# EAGLE design RedVThingPlus (EAGLE 9.1.0)

## Sheet 1 of 2
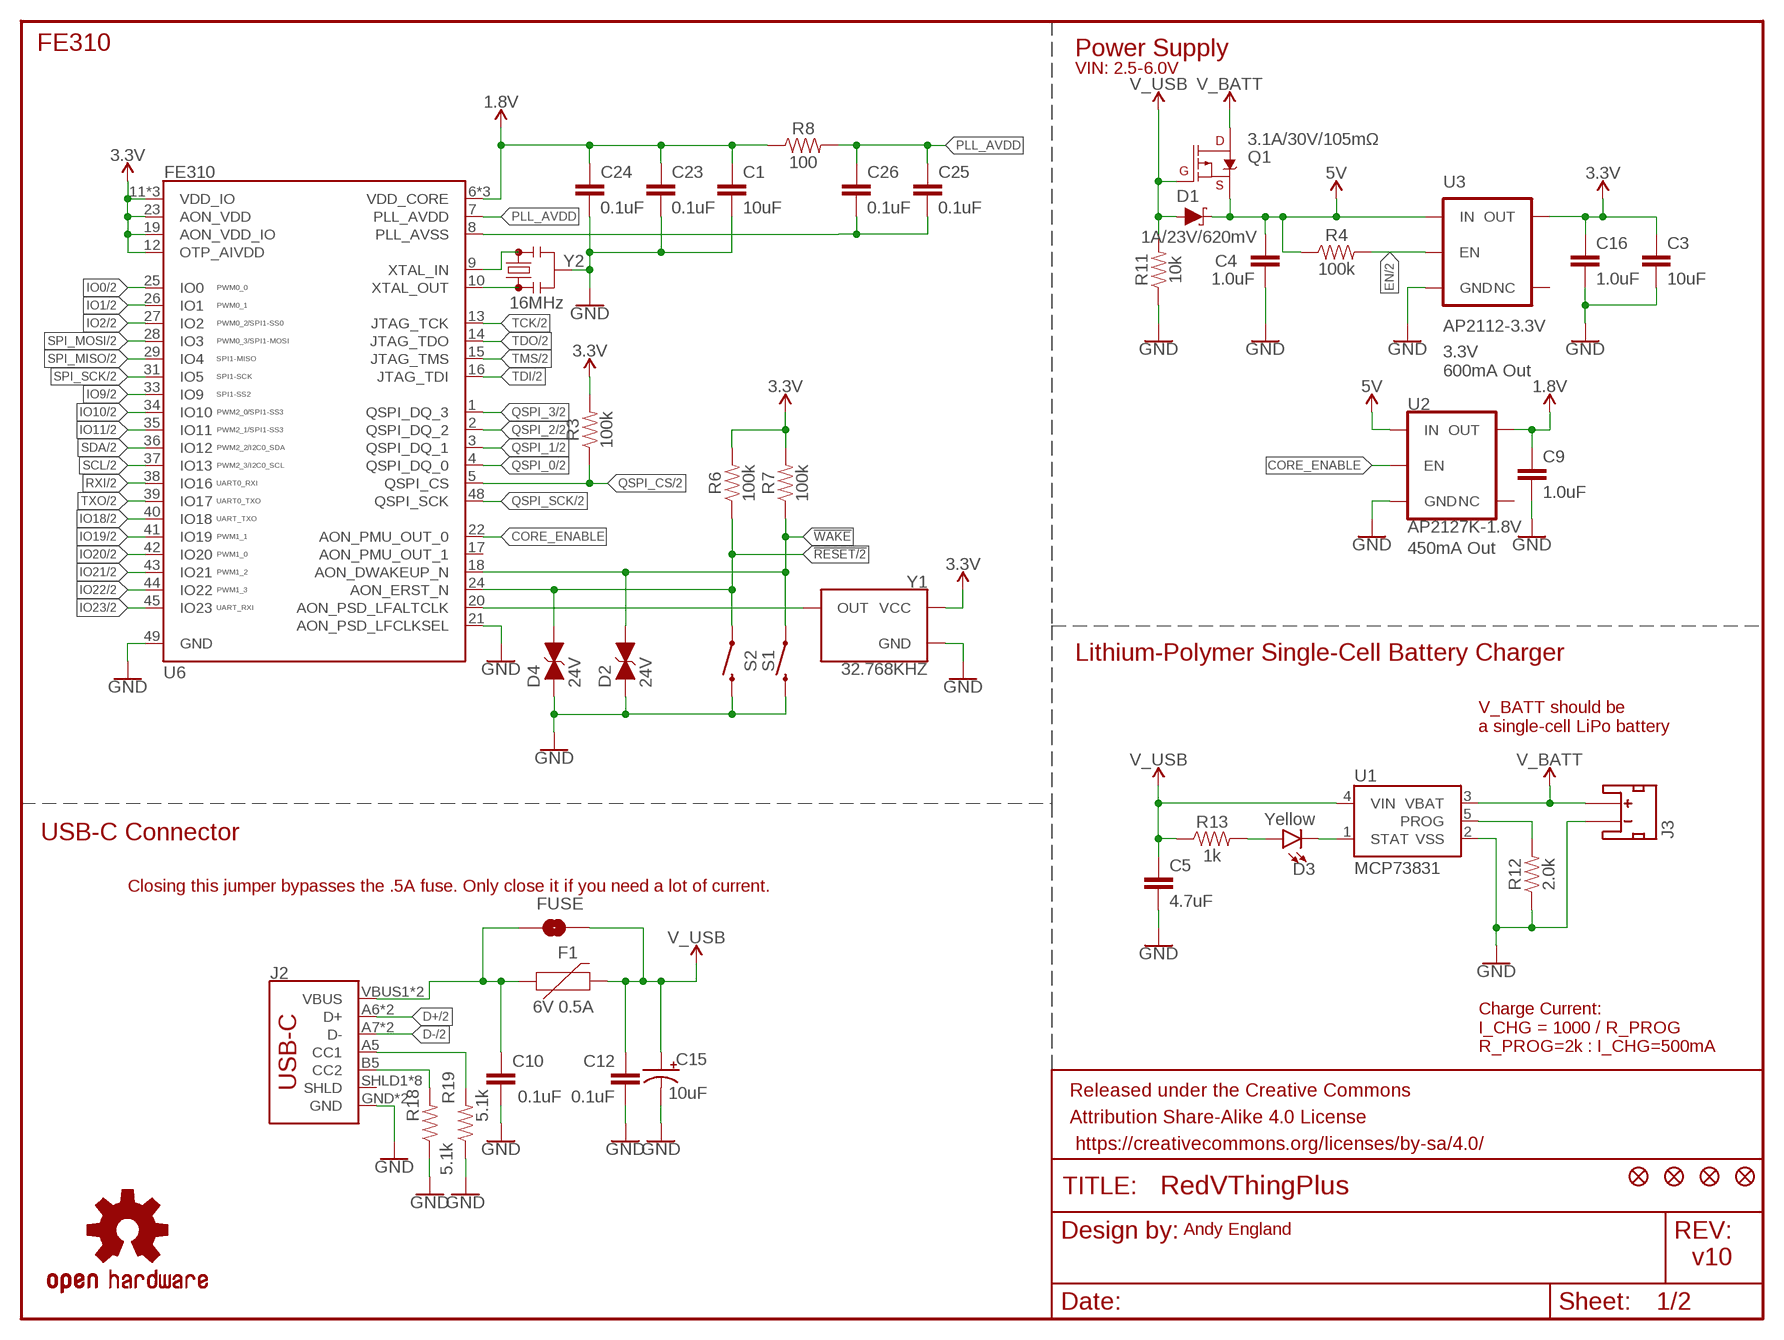
[diagram p0: schematic, sheet 1]

### Parts
C1  10uF  10UF-0603-6.3V-20%  [0603]
C3  10uF  10UF-0603-6.3V-20%  [0603]
C4  1.0uF  1.0UF-0603-16V-10%  [0603]
C5  4.7uF  4.7UF-0603-6.3V-(10%)  [0603]
C9  1.0uF  1.0UF-0603-16V-10%  [0603]
C10  0.1uF  0.1UF-0603-25V-(+80/-20%)  [0603]
C12  0.1uF  0.1UF-0603-25V-(+80/-20%)  [0603]
C15  10uF  10UF-POLAR-EIA3216-16V-10%(TANT)  [EIA3216]
C16  1.0uF  1.0UF-0603-16V-10%  [0603]
C23  0.1uF  0.1UF-0603-25V-(+80/-20%)  [0603]
C24  0.1uF  0.1UF-0603-25V-(+80/-20%)  [0603]
C25  0.1uF  0.1UF-0603-25V-(+80/-20%)  [0603]
C26  0.1uF  0.1UF-0603-25V-(+80/-20%)  [0603]
D1  1A/23V/620mV  DIODE-SCHOTTKY-BAT20J  [SOD-323]
D2  24V  DIODE_TVS  [0603]
D3  Yellow  LED-YELLOW0603  [LED-0603]
D4  24V  DIODE_TVS  [0603]
F1  6V 0.5A  PPTC_6V500MA  [0805]
FRAME2  FRAME-LETTER  [CREATIVE_COMMONS]
FUSE  JUMPER-SMT_2_NO_NO-SILK  [SMT-JUMPER_2_NO_NO-SILK]
J2  USB Female Type C Connector  USB_C2-LAYER  [USB-C-16P]
J3  JST_2MM_MALE  [JST-2-SMD]
JP8  FIDUCIAL1X2  [FIDUCIAL-1X2]
JP9  FIDUCIAL1X2  [FIDUCIAL-1X2]
JP15  FIDUCIAL1X2  [FIDUCIAL-1X2]
JP16  FIDUCIAL1X2  [FIDUCIAL-1X2]
Q1  3.1A/30V/105mΩ  MOSFET_PCH-DMG2307L  [SOT23-3]
R3  100k  100KOHM-0603-1/10W-1%  [0603]
R4  100k  100KOHM-0603-1/10W-1%  [0603]
R6  100k  100KOHM-0603-1/10W-1%  [0603]
R7  100k  100KOHM-0603-1/10W-1%  [0603]
R8  100  100OHM-0603-1/10W-1%  [0603]
R11  10k  10KOHM-0603-1/10W-1%  [0603]
R12  2.0k  2.0KOHM-0603-1/10W-5%  [0603]
R13  1k  1KOHM-0603-1/10W-1%  [0603]
R18  5.1k  5.1KOHM5.1KOHM-0603-1/10W-1%  [0603]
R19  5.1k  5.1KOHM5.1KOHM-0603-1/10W-1%  [0603]
S1  MOMENTARY-SWITCH-SPST-SMD-4.6X2.8MM  [TACTILE_SWITCH_SMD_4.6X2.8MM]
S2  MOMENTARY-SWITCH-SPST-SMD-4.6X2.8MM  [TACTILE_SWITCH_SMD_4.6X2.8MM]
U1  MCP73831  [SOT23-5]
U2  AP2127K-1.8V  V_REG_AP2127K-1.8V  [SOT23-5]
U3  AP2112-3.3V  V_REG_AP2112K-3.3V  [SOT23-5]
U6  FE310  SIFIVE_FE310  [QFN-48-.4MMPITCH]
U$16  OSHW-LOGOS  [OSHW-LOGO-S]
Y1  32.768KHZ  SITIME-CRYSTAL-32.768KHZ  [CRYSTAL-SMD-2X1.2MM]
Y2  16MHz  RESONATOR-16MHZSMD_3.2X1.3  [RESONATOR-SMD-3.2X1.3]

### Nets
1.8V: C1.1 C9.1 C23.1 C24.1 R8.1 U2.5(OUT) U6.6(VDD_CORE) U6.30(VDD_CORE) U6.46(VDD_CORE)
3.3V: C3.1 C16.1 R3.2 R6.2 R7.2 U3.5(OUT) U6.11(VDD_IO) U6.12(OTP_AIVDD) U6.19(AON_VDD_IO) U6.23(AON_VDD) U6.32(VDD_IO) U6.47(VDD_IO) Y1.4(VCC) ; also sheet 2
5V: C4.1 D1.C Q1.2(S) R4.1 U2.1(IN) U3.1(IN)
!RESET: D4.2(C) R6.1 S2.1 S2.2 U6.24(AON_ERST_N) ; also sheet 2
!WAKE: D2.2(C) R7.1 S1.1 S1.2 U6.18(AON_DWAKEUP_N)
CORE_ENABLE: U2.3(EN) U6.22(AON_PMU_OUT_0)
D+: J2.A6(D+) J2.B6(D+) ; also sheet 2
D-: J2.A7(D-) J2.B7(D-) ; also sheet 2
EN: R4.2 U3.3(EN) ; also sheet 2
GND: C1.2 C3.2 C4.2 C5.2 C9.2 C10.2 C12.2 C15.- C16.2 C23.2 C24.2 D2.1(A) D4.1(A) J2.GND J2.GND2(GND) J3.1(-) R11.1 R12.1 R18.1 R19.1 S1.3 S1.4 S2.3 S2.4 U1.2(VSS) U2.2(GND) U3.2(GND) U6.21(AON_PSD_LFCLKSEL) U6.49(GND) Y1.2(GND) Y2.2 ; also sheet 2
IO0: U6.25(IO0) ; also sheet 2
IO1: U6.26(IO1) ; also sheet 2
IO2: U6.27(IO2) ; also sheet 2
IO9: U6.33(IO9) ; also sheet 2
IO10: U6.34(IO10) ; also sheet 2
IO11: U6.35(IO11) ; also sheet 2
IO18: U6.40(IO18) ; also sheet 2
IO19: U6.41(IO19) ; also sheet 2
IO20: U6.42(IO20) ; also sheet 2
IO21: U6.43(IO21) ; also sheet 2
IO22: U6.44(IO22) ; also sheet 2
IO23: U6.45(IO23) ; also sheet 2
N$3: U6.10(XTAL_OUT) Y2.1
N$7: U6.9(XTAL_IN) Y2.3
N$8: U6.20(AON_PSD_LFALTCLK) Y1.3(OUT)
N$9: R12.2 U1.5(PROG)
N$10: C25.2 C26.2 U6.8(PLL_AVSS)
N$11: D3.C U1.1(STAT)
N$12: J2.B5(CC2) R18.2
N$14: D3.A R13.2
N$17: J2.A5(CC1) R19.2
PLL_AVDD: C25.1 C26.1 R8.2 U6.7(PLL_AVDD)
QSPI_0: U6.4(QSPI_DQ_0) ; also sheet 2
QSPI_1: U6.3(QSPI_DQ_1) ; also sheet 2
QSPI_2: U6.2(QSPI_DQ_2) ; also sheet 2
QSPI_3: U6.1(QSPI_DQ_3) ; also sheet 2
QSPI_CS: R3.1 U6.5(QSPI_CS) ; also sheet 2
QSPI_SCK: U6.48(QSPI_SCK) ; also sheet 2
RXI: U6.38(IO16) ; also sheet 2
SCL: U6.37(IO13) ; also sheet 2
SDA: U6.36(IO12) ; also sheet 2
SPI_MISO: U6.29(IO4) ; also sheet 2
SPI_MOSI: U6.28(IO3) ; also sheet 2
SPI_SCK: U6.31(IO5) ; also sheet 2
TCK: U6.13(JTAG_TCK) ; also sheet 2
TDI: U6.16(JTAG_TDI) ; also sheet 2
TDO: U6.14(JTAG_TDO) ; also sheet 2
TMS: U6.15(JTAG_TMS) ; also sheet 2
TXO: U6.39(IO17) ; also sheet 2
V_BATT: J3.2(+) Q1.3(D) U1.3(VBAT) ; also sheet 2
V_USB: C5.1 C12.1 C15.+ D1.A F1.2 FUSE.2 Q1.1(G) R11.2 R13.1 U1.4(VIN) ; also sheet 2
VUSB: C10.1 F1.1 FUSE.1 J2.VBUS1(VBUS) J2.VBUS2(VBUS)
Unconnected: J2.SHLD1(SHLD) J2.SHLD2(SHLD) J2.SHLD3(SHLD) J2.SHLD4(SHLD) J2.SHLD5(SHLD) J2.SHLD6(SHLD) J2.SHLD7(SHLD) J2.SHLD8(SHLD) J3.NC1(PAD1) J3.NC2(PAD2) U2.4(NC) U3.4(NC) U6.17(AON_PMU_OUT_1)

### Notes on the sheet
- FE310 | Power Supply
- VIN: 2.5-6.0V
- 3.3V
  600mA Out
- 450mA Out
- Lithium-Polymer Single-Cell Battery Charger
- V_BATT should be
  a single-cell LiPo battery
- USB-C Connector
- Closing this jumper bypasses the .5A fuse. Only close it if you need a lot of current.
- Charge Current:
  I_CHG = 1000 / R_PROG
  R_PROG=2k : I_CHG=500mA
- Andy England
- v10

## Sheet 2 of 2
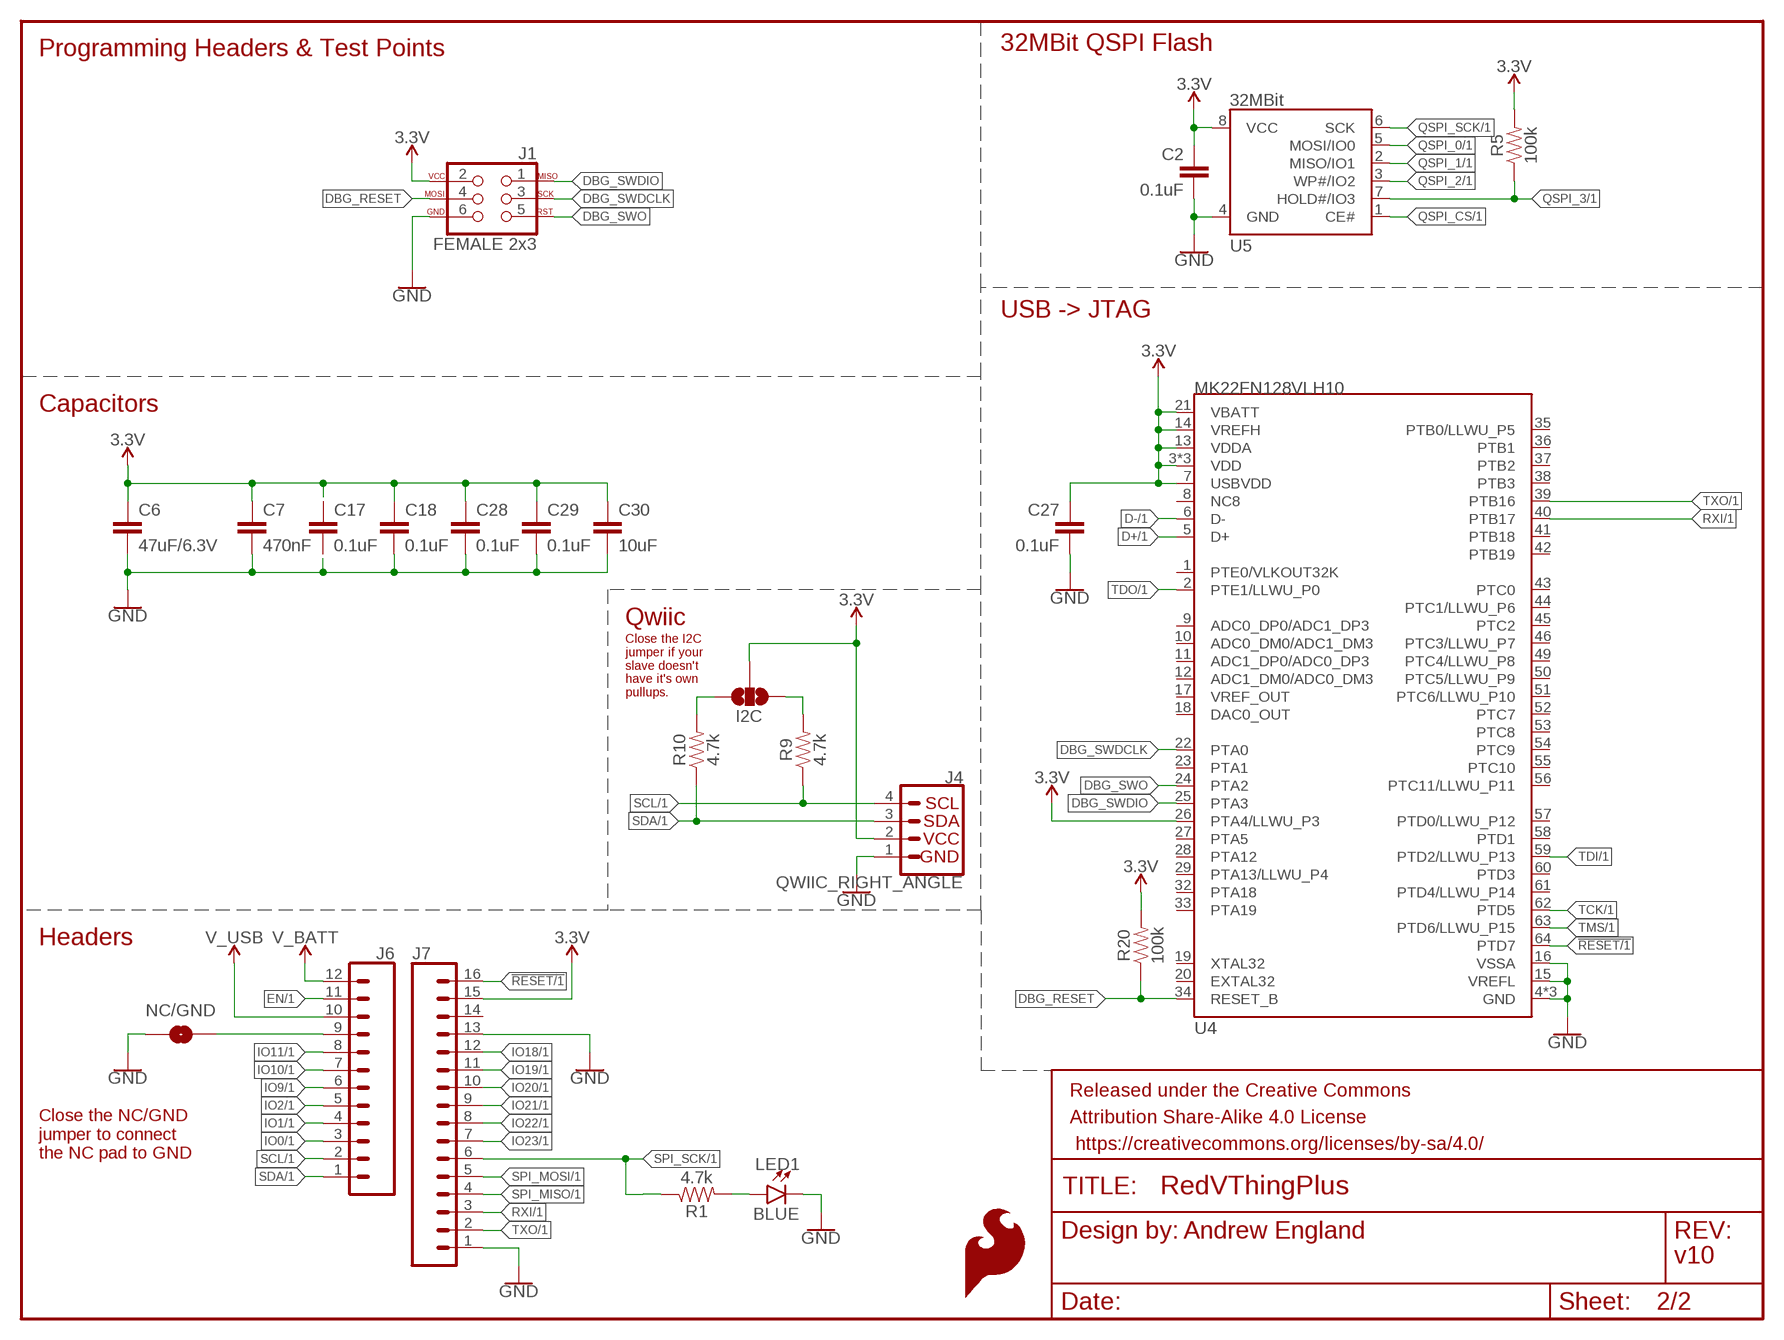
[diagram p1: schematic, sheet 2]

### Parts
C2  0.1uF  0.1UF-0603-25V-(+80/-20%)  [0603]
C6  47uF/6.3V  47UF  [0805]
C7  470nF  470NF-0603-10V-10%-X5R  [0603]
C17  0.1uF  0.1UF-0603-25V-(+80/-20%)  [0603]
C18  0.1uF  0.1UF-0603-25V-(+80/-20%)  [0603]
C27  0.1uF  0.1UF-0603-25V-(+80/-20%)  [0603]
C28  0.1uF  0.1UF-0603-25V-(+80/-20%)  [0603]
C29  0.1uF  0.1UF-0603-25V-(+80/-20%)  [0603]
C30  10uF  10UF-0603-6.3V-20%  [0603]
FRAME1  FRAME-LETTER  [CREATIVE_COMMONS]
I2C  JUMPER-SMT_3_NO_NO-SILK  [SMT-JUMPER_3_NO_NO-SILK]
J1  FEMALE 2x3  AVR_SPI_PROG_3X2TESTPOINTS  [2X3_TEST_POINTS]
J4  QWIIC_RIGHT_ANGLE  QWIIC_CONNECTORJS-1MM  [JST04_1MM_RA]
J6  CONN_12SM_SQ_NO_SILK  [1X12_SM_SQ_NOSILK]
J7  CONN_161X16_SM_SQ_NOSILK  [1X16_SM_SQ_NOSILK]
LED1  BLUE  LED-BLUE0603  [LED-0603]
LOGO2  SFE_LOGO_FLAME.2_INCH  [SFE_LOGO_FLAME_.2]
NC/GND  JUMPER-SMT_2_NO_NO-SILK  [SMT-JUMPER_2_NO_NO-SILK]
R1  4.7k  4.7KOHM-0603-1/10W-1%  [0603]
R5  100k  100KOHM-0603-1/10W-1%  [0603]
R9  4.7k  4.7KOHM-0603-1/10W-1%  [0603]
R10  4.7k  4.7KOHM-0603-1/10W-1%  [0603]
R20  100k  100KOHM-0603-1/10W-1%  [0603]
U4  MK22FN128VLH10  [LQFP-64]
U5  32MBit  QSPI32MBIT  [SO08]

### Nets
3.3V: C2.1 C6.1 C7.1 C17.1 C18.1 C27.1 C28.1 C29.1 C30.1 I2C.2 J1.2 J4.2 J7.15 R5.2 R20.2 U4.3(VDD) U4.7(USBVDD) U4.13(VDDA) U4.14(VREFH) U4.21(VBATT) U4.26(PTA4/LLWU_P3) U4.30(VDD) U4.48(VDD) U5.8(VCC) ; also sheet 1
!RESET: J7.16 U4.64(PTD7) ; also sheet 1
D+: U4.5(D+) ; also sheet 1
D-: U4.6(D-) ; also sheet 1
DBG_RESET: J1.4 R20.1 U4.34(RESET_B)
DBG_SWDCLK: J1.3 U4.22(PTA0)
DBG_SWDIO: J1.1 U4.25(PTA3)
DBG_SWO: J1.5 U4.24(PTA2)
EN: J6.11 ; also sheet 1
GND: C2.2 C6.2 C7.2 C17.2 C18.2 C27.2 C28.2 C29.2 C30.2 J1.6 J4.1 J7.1 J7.13 LED1.C NC/GND.1 U4.4(GND) U4.15(VREFL) U4.16(VSSA) U4.31(GND) U4.47(GND) U5.4(GND) ; also sheet 1
IO0: J6.3 ; also sheet 1
IO1: J6.4 ; also sheet 1
IO2: J6.5 ; also sheet 1
IO9: J6.6 ; also sheet 1
IO10: J6.7 ; also sheet 1
IO11: J6.8 ; also sheet 1
IO18: J7.12 ; also sheet 1
IO19: J7.11 ; also sheet 1
IO20: J7.10 ; also sheet 1
IO21: J7.9 ; also sheet 1
IO22: J7.8 ; also sheet 1
IO23: J7.7 ; also sheet 1
N$1: LED1.A R1.2
N$4: J6.9 NC/GND.2
N$5: I2C.1 R9.2
N$6: I2C.3 R10.2
QSPI_0: U5.5(MOSI/IO0) ; also sheet 1
QSPI_1: U5.2(MISO/IO1) ; also sheet 1
QSPI_2: U5.3(WP#/IO2) ; also sheet 1
QSPI_3: R5.1 U5.7(HOLD#/IO3) ; also sheet 1
QSPI_CS: U5.1(CE#) ; also sheet 1
QSPI_SCK: U5.6(SCK) ; also sheet 1
RXI: J7.3 U4.40(PTB17) ; also sheet 1
SCL: J4.4 J6.2 R9.1 ; also sheet 1
SDA: J4.3 J6.1 R10.1 ; also sheet 1
SPI_MISO: J7.4 ; also sheet 1
SPI_MOSI: J7.5 ; also sheet 1
SPI_SCK: J7.6 R1.1 ; also sheet 1
TCK: U4.62(PTD5) ; also sheet 1
TDI: U4.59(PTD2/LLWU_P13) ; also sheet 1
TDO: U4.2(PTE1/LLWU_P0) ; also sheet 1
TMS: U4.63(PTD6/LLWU_P15) ; also sheet 1
TXO: J7.2 U4.39(PTB16) ; also sheet 1
V_BATT: J6.12 ; also sheet 1
V_USB: J6.10 ; also sheet 1
Unconnected: J7.14 U4.1(PTE0/VLKOUT32K) U4.8(NC8) U4.9(ADC0_DP0/ADC1_DP3) U4.10(ADC0_DM0/ADC1_DM3) U4.11(ADC1_DP0/ADC0_DP3) U4.12(ADC1_DM0/ADC0_DM3) U4.17(VREF_OUT) U4.18(DAC0_OUT) U4.19(XTAL32) U4.20(EXTAL32) U4.23(PTA1) U4.27(PTA5) U4.28(PTA12) U4.29(PTA13/LLWU_P4) U4.32(PTA18) U4.33(PTA19) U4.35(PTB0/LLWU_P5) U4.36(PTB1) U4.37(PTB2) U4.38(PTB3) U4.41(PTB18) U4.42(PTB19) U4.43(PTC0) U4.44(PTC1/LLWU_P6) U4.45(PTC2) U4.46(PTC3/LLWU_P7) U4.49(PTC4/LLWU_P8) U4.50(PTC5/LLWU_P9) U4.51(PTC6/LLWU_P10) U4.52(PTC7) U4.53(PTC8) U4.54(PTC9) U4.55(PTC10) U4.56(PTC11/LLWU_P11) U4.57(PTD0/LLWU_P12) U4.58(PTD1) U4.60(PTD3) U4.61(PTD4/LLWU_P14)

### Notes on the sheet
- Programming Headers & Test Points | 32MBit QSPI Flash
- USB -> JTAG
- Capacitors
- Qwiic
- Close the I2C
  jumper if your
  slave doesn't
  have it's own
  pullups.
- Headers
- Close the NC/GND
  jumper to connect
  the NC pad to GND
- Andrew England
- v10

## Library data of the parts
C1 C3 C30 = SparkFun-Capacitors:10UF: 10.0µF ceramic capacitors A capacitor is a passive two-terminal electrical component used to store electrical energy temporarily in an electric field.; PROD_ID: CAP-11015
C2 C10 C12 C17 C18 C23-C29 = SparkFun-Capacitors:0.1UF: 0.1µF ceramic capacitors A capacitor is a passive two-terminal electrical component used to store electrical energy temporarily in an electric field.; PROD_ID: CAP-00810
C4 C9 C16 = SparkFun-Capacitors:1.0UF: 1µF ceramic capacitors A capacitor is a passive two-terminal electrical component used to store electrical energy temporarily in an electric field.; PROD_ID: CAP-00868
C5 = SparkFun-Capacitors:4.7UF: 4.7µF ceramic capacitors A capacitor is a passive two-terminal electrical component used to store electrical energy temporarily in an electric field.; PROD_ID: CAP-08280
C6 = SparkFun-Capacitors:47UF; PROD_ID: CAP-13854
C7 = SparkFun-Capacitors:470NF: 0.47uF/470nF ceramic capacitors A capacitor is a passive two-terminal electrical component used to store electrical energy temporarily in an electric field.; PROD_ID: CAP-13216
C15 = SparkFun-Capacitors:10UF-POLAR: 10.0µF polarized capacitors A capacitor is a passive two-terminal electrical component used to store electrical energy temporarily in an electric field.; PROD_ID: CAP-00811
D1 = SparkFun-DiscreteSemi:DIODE-SCHOTTKY: Schottky diode A Schottky diode is a semiconductor diode which has a low forward voltage drop and a very fast switching action.; PROD_ID: DIO-11623
D2 D4 = SparkFun-DiscreteSemi:DIODE_TVS; PROD_ID: DIO-14502
D3 = SparkFun-LED:LED-YELLOW: Yellow SMD LED Used in manufacturing several products at SparkFun. Packages: 0603 - SMD 0603 package[Product Link] <http://www.kingbrightusa.com/product.asp?catalog_name=LED&product_id=APT1608SYCK> 0603 -SMART - SMART SMD 0603 package (more efficient/more expensive) [Product Link] <http://www.osram-os.com/osram_os/en/products/product-catalog/led-light-emitting-diodes/smartled-0603/ly-l29k/index.jsp> LilyPad - SMD1206 package[Product Datasheet] <https://www.sparkfun.com/datasheets/DevTools/LilyPad/Q150YUS4.pdf> SparkFun Products: Blynk Board <https://www.sparkfun.com/products/13794> IOIO-OTG <https://www.sparkfun.com/products/13613> XBee Explorer Serial <https://www.sparkfun.com/products/13225>; PROD_ID: DIO-09003
F1 = SparkFun-Fuses:PPTC: Resettable Fuse PPTC Resettable Fuse. Really a sort of resistor with a polymeric positive temperature coefficient whose resistance increases dramatically with an increase in temperature. When heated by the power passing through the resistance rises causing the current to be limited, protecting the circuit. This is achieved by the transition of the polymer from a crystalline to an amorphous state where the conductive carbon separates breaking the conductive pathways found in the cool crystalline structure. When a PPTC cools back down it resumes conducting letting the circuit turn back on. SparkFun Products: SparkFun RedBoard - Programmed with Arduino <https://www.sparkfun.com/products/12757> Pro Micro - 5V/16MHz <https://www.sparkfun.com/products/12640> Arduino Pro 328 - 5V/16MHz <https://www.sparkfun.com/products/10915> MP3 Trigger <https://www.sparkfun.com/products/13720>; PROD_ID: RES-13945
FRAME1 FRAME2 = SparkFun-Aesthetics:FRAME-LETTER: Schematic Frame - Letter Standard 8.5x11 US Letter frame
FUSE NC/GND = SparkFun-Jumpers:JUMPER-SMT_2_NO: Normally open jumper This jumper has two pads in close proximity to each other. Apply solder to close the connection. Round pads are easier to solder for beginners, but are a lot larger. SparkFun Product that uses the round pads: SparkFun EL Sequencer <https://www.sparkfun.com/products/12781>
I2C = SparkFun-Jumpers:JUMPER-SMT_3_NO: Normally open jumper This jumper has three pads in close proximity to each other. Apply solder to close the connection(s).
J1 = SparkFun-Connectors:AVR_SPI_PROG_3X2: AVR ISP 6 Pin This is the reduced ISP connector for AVR programming. Common on Arduino. This footprint will take up less PCB space and can be used with a 10-pin to 6-pin adapter such as SKU: BOB-08508 **Special note about "TEST_POINT" package. The stop mask is on the top side, so if you want your programming test points to be on the bottom of your board, make sure to place this package on the bottom side of the board. This also ensure that the orientation to program from the bottom side will be correct. SparkFun Products: SparkFun ISP Pogo Adapter <https://www.sparkfun.com/products/11591> - NS Tiny AVR Programmer <https://www.sparkfun.com/products/11801> -PTH
J2 = SparkFun-Connectors:USB_C: USB Type C 16Pin Connector Super Speed pins not available on the 16-pin purely SMD connector so this part is best for USB 2.0 implementations. D1 and D2 are tied together enabling D+/- no matter which way the cable is plugged into the connector. The two channel configuration pins (CC1/2) are exposed. These are normally connected to ground via 5.1k resistors but can be reconfigured for high current/high power applications.; PROD_ID: CONN-14122
J3 = SparkFun-Connectors:JST_2MM_MALE: JST 2MM MALE RA CONNECTOR Two pin, compact surface mount connector. Commonly used as a battery input connection point. We really like the solid locking feeling and high current rating on these small connectors. We use these all the time as battery connectors. Mates to single-cell LiPo batteries. Here is the connector we sell at SparkFun: JST Right Angle Connector - White <https://www.sparkfun.com/products/8612> (PRT-08612) Datasheet <http://www.sparkfun.com/datasheets/Prototyping/Connectors/JST-Horizontal.pdf> It was used on these SparkFun products: SparkFun MOSFET Power Controller <https://www.sparkfun.com/products/11214> (PRT-11214) SparkFun Battery Babysitter - LiPo Battery Manager <https://www.sparkfun.com/products/13777> (PRT-13777) And many, many others that required a lipo battery connection.; PROD_ID: CONN-11443; SF_ID: PRT-08612
J4 = SparkFun-Connectors:QWIIC_CONNECTOR: SparkFun I2C Standard Qwiic Connector An SMD 1mm pitch JST connector makes it easy and quick (get it? Qwiic?) to connect I2C devices to each other. The Qwiic system <http://www.sparkfun.com/qwiic> enables fast and solderless connection between popular platforms and various sensors and actuators. We carry 200mm <https://www.sparkfun.com/products/14204>, 100mm <https://www.sparkfun.com/products/14205>, 50mm <https://www.sparkfun.com/products/14206>, and breadboard friendly <https://www.sparkfun.com/products/14207> Qwiic cables. We also offer 10 pcs strips <https://www.sparkfun.com/products/14323> the SMD connectors.; PROD_ID: CONN-13694
J6 = SparkFun-Connectors:CONN_12: Multi connection point. Often used as Generic Header-pin footprint for 0.1 inch spaced/style header connections On any of the 0.1 inch spaced packages, you can populate with these: Break Away Headers - Straight <https://www.sparkfun.com/products/116> (PRT-00116) Break Away Male Headers - Right Angle <https://www.sparkfun.com/products/553> (PRT-00553) Female Headers <https://www.sparkfun.com/products/115> (PRT-00115) Break Away Headers - Machine Pin <https://www.sparkfun.com/products/117> (PRT-00117) Break Away Female Headers - Swiss Machine Pin <https://www.sparkfun.com/products/743> (PRT-00743) For SCREWTERMINALS and SPRING TERMINALS visit here: Screw Terimnals on SparkFun.com <https://www.sparkfun.com/search/results?term=Screw+Terminals> (5mm/3.5mm/2.54mm spacing) This device is also useful as a general connection point to wire up your design to another part of your project. Our various solder wires solder well into these plated through hole pads. Hook-Up Wire - Assortment (Stranded, 22 AWG) <https://www.sparkfun.com/products/11375> (PRT-11375) Hook-Up Wire - Assortment (Solid Core, 22 AWG) <https://www.sparkfun.com/products/11367> (PRT-11367) View the entire wire category on our website here <https://www.sparkfun.com/categories/141> Special notes: Molex polarized connector foot print use with SKU : PRT-08231 with associated crimp pins and housings. 1MM SMD Version SKU: PRT-10208 NOTES ON THE VARIANTS LOCK and LOCK_LONGPADS... This footprint was designed to help hold the alignment of a through-hole component (i.e. 6-pin header) while soldering it into place. You may notice that each hole has been shifted either up or down by 0.005 of an inch from it's more standard position (which is a perfectly straight line). This slight alteration caused the pins (the squares in the middle) to touch the edges of the holes. Because they are alternating, it causes a "brace" to hold the component in place. 0.005 has proven to be the perfect amount of "off-center" position when using our standard breakaway headers. Although looks a little odd when you look at the bare footprint, once you have a header in there, the alteration is very hard to notice. Also,if you push a header all the way into place, it is covered up entirely on the bottom side.
J7 = SparkFun-Connectors:CONN_16: Multi connection point. Often used as Generic Header-pin footprint for 0.1 inch spaced/style header connections On any of the 0.1 inch spaced packages, you can populate with these: Break Away Headers - Straight <https://www.sparkfun.com/products/116> (PRT-00116) Break Away Male Headers - Right Angle <https://www.sparkfun.com/products/553> (PRT-00553) Female Headers <https://www.sparkfun.com/products/115> (PRT-00115) Break Away Headers - Machine Pin <https://www.sparkfun.com/products/117> (PRT-00117) Break Away Female Headers - Swiss Machine Pin <https://www.sparkfun.com/products/743> (PRT-00743) For SCREWTERMINALS and SPRING TERMINALS visit here: Screw Terimnals on SparkFun.com <https://www.sparkfun.com/search/results?term=Screw+Terminals> (5mm/3.5mm/2.54mm spacing) This device is also useful as a general connection point to wire up your design to another part of your project. Our various solder wires solder well into these plated through hole pads. Hook-Up Wire - Assortment (Stranded, 22 AWG) <https://www.sparkfun.com/products/11375> (PRT-11375) Hook-Up Wire - Assortment (Solid Core, 22 AWG) <https://www.sparkfun.com/products/11367> (PRT-11367) View the entire wire category on our website here <https://www.sparkfun.com/categories/141> Special notes: Molex polarized connector foot print use with SKU : PRT-08231 with associated crimp pins and housings. 1MM SMD Version SKU: PRT-10208 NOTES ON THE VARIANTS LOCK and LOCK_LONGPADS... This footprint was designed to help hold the alignment of a through-hole component (i.e. 6-pin header) while soldering it into place. You may notice that each hole has been shifted either up or down by 0.005 of an inch from it's more standard position (which is a perfectly straight line). This slight alteration caused the pins (the squares in the middle) to touch the edges of the holes. Because they are alternating, it causes a "brace" to hold the component in place. 0.005 has proven to be the perfect amount of "off-center" position when using our standard breakaway headers. Although looks a little odd when you look at the bare footprint, once you have a header in there, the alteration is very hard to notice. Also,if you push a header all the way into place, it is covered up entirely on the bottom side.
JP8 JP9 JP15 JP16 = SparkFun:FIDUCIAL: Fiducial Alignment Points Various fiducial points for machine vision alignment.
LED1 = SparkFun-LED:LED-BLUE: Blue SMD LED Used in manufacturing of various products at SparkFun Packages: 0603 - SMD 0603 package [Product Link] <http://www.digikey.com/product-detail/en/SMLE12BC7TT86/511-1589-2-ND/1641808> 1206 - SMD1206 package [Product Link] <http://www.digikey.com/product-detail/en/lite-on-inc/LTST-C150TBKT/160-1643-1-ND/573584> SparkFun Products: ESP8266 Thing-Dev Board <https://www.sparkfun.com/products/13711> RedBoard <https://www.sparkfun.com/products/12757>; PROD_ID: DIO-08575
LOGO2 = SparkFun-Aesthetics:SFE_LOGO_FLAME: SparkFun Flame Logo This is the SparkFun flame logo. The logo on the schematic will always be the same size; the package variant is the height of the flame. Default layer for the logo on the board is tSilk.
Q1 = SparkFun-DiscreteSemi:MOSFET_PCH: P-channel MOSFETs Voltage controlled devices that allow control of high current outputs. SparkFun Products: SparkFun ESP32 Thing <https://www.sparkfun.com/products/13907> SparkFun ESP8266 Thing <https://www.sparkfun.com/products/13231> SparkFun Pi Servo HAT V2 <https://www.sparkfun.com/products/15316> DMG2305UX-7 (20V/4.2A/SOT23-3); PROD_ID: TRANS-11308
R1 R9 R10 = SparkFun-Resistors:4.7KOHM: 4.7kΩ resistor A resistor is a passive two-terminal electrical component that implements electrical resistance as a circuit element. Resistors act to reduce current flow, and, at the same time, act to lower voltage levels within circuits. - Wikipedia; PROD_ID: RES-07857
R3-R7 R20 = SparkFun-Resistors:100KOHM: 100kΩ resistor A resistor is a passive two-terminal electrical component that implements electrical resistance as a circuit element. Resistors act to reduce current flow, and, at the same time, act to lower voltage levels within circuits. - Wikipedia; PROD_ID: RES-07828
R8 = SparkFun-Resistors:100OHM: 100Ω resistor A resistor is a passive two-terminal electrical component that implements electrical resistance as a circuit element. Resistors act to reduce current flow, and, at the same time, act to lower voltage levels within circuits. - Wikipedia; PROD_ID: RES-07863
R11 = SparkFun-Resistors:10KOHM: 10kΩ resistor A resistor is a passive two-terminal electrical component that implements electrical resistance as a circuit element. Resistors act to reduce current flow, and, at the same time, act to lower voltage levels within circuits. - Wikipedia; PROD_ID: RES-00824
R12 = SparkFun-Resistors:2.0KOHM: 2kΩ resistor A resistor is a passive two-terminal electrical component that implements electrical resistance as a circuit element. Resistors act to reduce current flow, and, at the same time, act to lower voltage levels within circuits. - Wikipedia; PROD_ID: RES-08296
R13 = SparkFun-Resistors:1KOHM: 1kΩ resistor A resistor is a passive two-terminal electrical component that implements electrical resistance as a circuit element. Resistors act to reduce current flow, and, at the same time, act to lower voltage levels within circuits. - Wikipedia; PROD_ID: RES-07856
R18 R19 = SparkFun-Resistors:5.1KOHM; PROD_ID: RES-12083
S1 S2 = SparkFun-Switches:MOMENTARY-SWITCH-SPST: Momentary Switch (Pushbutton) - SPST Normally-open (NO) SPST momentary switches (buttons, pushbuttons). Variants PTH-12MM - 12mm square, through-hole Momentary Pushbutton Switch - 12mm Square <https://www.sparkfun.com/products/9190> (COM-09190) PTH-6.0MM, PTH-6.0MM-KIT - 6.0mm square, through-hole Mini Pushbutton Switch <https://www.sparkfun.com/products/97> (COM-00097) KIT package intended for soldering kit's - only one side of pads' copper is exposed. PTH-RIGHT-ANGLE-KIT - Right-angle, through-hole Right Angle Tactile Button <https://www.sparkfun.com/products/10791> - Used on SparkFun BigTime Watch Kit <https://www.sparkfun.com/products/11734> SMD-12MM - 12mm square, surface-mount Tactile Button - SMD (12mm) <https://www.sparkfun.com/products/12993> (COM-12993) Used on SparkFun PicoBoard <https://www.sparkfun.com/products/11888> SMD-4.5MM - 4.5mm Square Trackball Switch Used on SparkFun Blackberry Trackballer Breakout <https://www.sparkfun.com/products/13169> SMD-4.6MMX2.8MM - 4.60mm x 2.80mm, surface mount Used on SparkFun SAMD21 Mini Breakout <https://www.sparkfun.com/products/13664> SMD-5.2MM, SMD-5.2-REDUNDANT - 5.2mm square, surface-mount Mini Pushbutton Switch - SMD <https://www.sparkfun.com/products/8720> (COM-08720) Used on Arduino Pro Mini <https://www.sparkfun.com/products/11114> REDUNDANT package connects both switch circuits together SMD-6.0X3.5MM - 6.0 x 3.5mm, surface mount Momentary Reset Switch SMD <https://www.sparkfun.com/products/8229> (COM-08229) SMD-6.2MM-TALL - 6.2mm square, surface mount Tactile Button - SMD (6mm) <https://www.sparkfun.com/products/12992> Used on SparkFun Digital Sandbox <https://www.sparkfun.com/products/12651> SMD-RIGHT-ANGLE - Right-angle, surface mount Used on SparkFun Block for Intel® Edison - Arduino <https://www.sparkfun.com/products/13036>; PROD_ID: SWCH-13065
U1 = SparkFun-IC-Power:MCP73831: MCP73831T Li-Ion, Li-Pol Controller Miniature single cell, fully integrated Li-Ion, Li-polymer charge management controller Datasheet <http://ww1.microchip.com/downloads/en/DeviceDoc/20001984g.pdf> SparkFun Products: SparkFun ESP32 Thing <https://www.sparkfun.com/products/13907> SparkFun 9DoF Razor IMU M0 <https://www.sparkfun.com/products/14001>; PROD_ID: IC-09995
U2 = SparkFun-IC-Power:V_REG_AP2127: AP2127 - 300mA CMOS LDO Regulator w/ Enable The AP2127 is CMOS process low dropout linear regulator with enable function, the regulator delivers a guaranteed 300mA (min.) continuous load current. Features Output Voltage Accuracy: ±1.5% Output Current: 300mA (Min.) Foldback Short Current Protection: 50mA Enable Function to Turn ON/OFF VOUT Low Dropout Voltage (3.3V): 250mV (Typ.) @IOUT=600mA Excellent Load Regulation: 0.2%/A (Typ.) Excellent Line Regulation: 0.02%/V (Typ.) Low Quiescent Current: 55μA (Typ.) Low Standby Current: 0.01μA (Typ.) Low Output Noise: 50μVRMS PSRR: 100Hz -65dB, 1kHz -65dB OTSD Protection Stable with 1.0μF Flexible Cap: Ceramic, Tantalum and Aluminum Electrolytic Operation Temperature Range: -40°C to 85°C ESD: MM 400V, HBM 4000V; PROD_ID: VREG-14239
U3 = SparkFun-PowerIC:V_REG_AP2112: AP2112 - 600mA CMOS LDO Regulator w/ Enable The AP2112 is CMOS process low dropout linear regulator with enable function, the regulator delivers a guaranteed 600mA (min.) continuous load current. Features Output Voltage Accuracy: ±1.5% Output Current: 600mA (Min.) Foldback Short Current Protection: 50mA Enable Function to Turn ON/OFF VOUT Low Dropout Voltage (3.3V): 250mV (Typ.) @IOUT=600mA Excellent Load Regulation: 0.2%/A (Typ.) Excellent Line Regulation: 0.02%/V (Typ.) Low Quiescent Current: 55μA (Typ.) Low Standby Current: 0.01μA (Typ.) Low Output Noise: 50μVRMS PSRR: 100Hz -65dB, 1kHz -65dB OTSD Protection Stable with 1.0μF Flexible Cap: Ceramic, Tantalum and Aluminum Electrolytic Operation Temperature Range: -40°C to 85°C ESD: MM 400V, HBM 4000V; PROD_ID: VREG-12457; VALUE: 3.3V
U4 = SparkFun-IC-Comms:MK22FN128VLH10: The Kinetis K22 product family members are optimized for costsensitive applications requiring low-power, USB connectivity, high peripheral integration and processing efficiency with a floating-point unit. These devices share the comprehensive enablement and scalability of the Kinetis family.; PROD_ID: IC-14611
U5 = SparkFun-IC-Memory:QSPI32MBIT: Integrated Silicon Solution Inc. IS25LP032D The IS25LP032D Serial Flash memory offers a versatile storage solution with high flexibility and performance in a simplified pin count package. ISSI’s “Industry Standard Serial Interface” Flash is for systems that require limited space, a low pin count, and low power consumption. The device is accessed through a 4-wire SPI Interface consisting of a Serial Data Input (SI), Serial Data Output (SO), Serial Clock (SCK), and Chip Enable (CE#) pins, which can also be configured to serve as multi-I/O (see pin descriptions). Datasheet <http://www.issi.com/WW/pdf/25LP-WP032D.pdf>; PROD_ID: IC-14501
U6 = SparkFun-IC-Microcontroller:SIFIVE_FE310: SiFive FE310 - RISC-V MCU The FE310-G002 is the second Freedom E300 SoC. The FE310-G002 is built around the E31 Core Complex instantiated in the Freedom E300 platform. SparkFun Products: [PRODUCT 1] <[PRODUCT1LINK]>; PROD_ID: IC-14494
U$16 = SparkFun-Aesthetics:OSHW-LOGO: Open-Source Hardware (OSHW) Logo This logo indicates the piece of hardware it is found on incorporates a OSHW license and/or adheres to the definition of open source hardware found here: http://freedomdefined.org/OSHW
Y1 = SparkFun-Clocks:SITIME-CRYSTAL-32.768KHZ; PROD_ID: XTAL-14578
Y2 = SparkFun-Clocks:RESONATOR-16MHZ: 16MHz Resonator Digikey Example <http://www.digikey.com/product-detail/en/murata-electronics-north-america/CSTCE16M0V53-R0/490-1198-1-ND/584635> Frequency: 16MHz Frequency Stability: ±0.3% Frequency Tolerance: ±0.5% Capacitance: 15pF SparkFun Products SparkFun OpenLog <https://www.sparkfun.com/products/13712> SparkFun MicroView - OLED Arduino Module <https://www.sparkfun.com/products/12923>; PROD_ID: XTAL-08900

## Net classes
1 power: width 0.178 mm

## Board
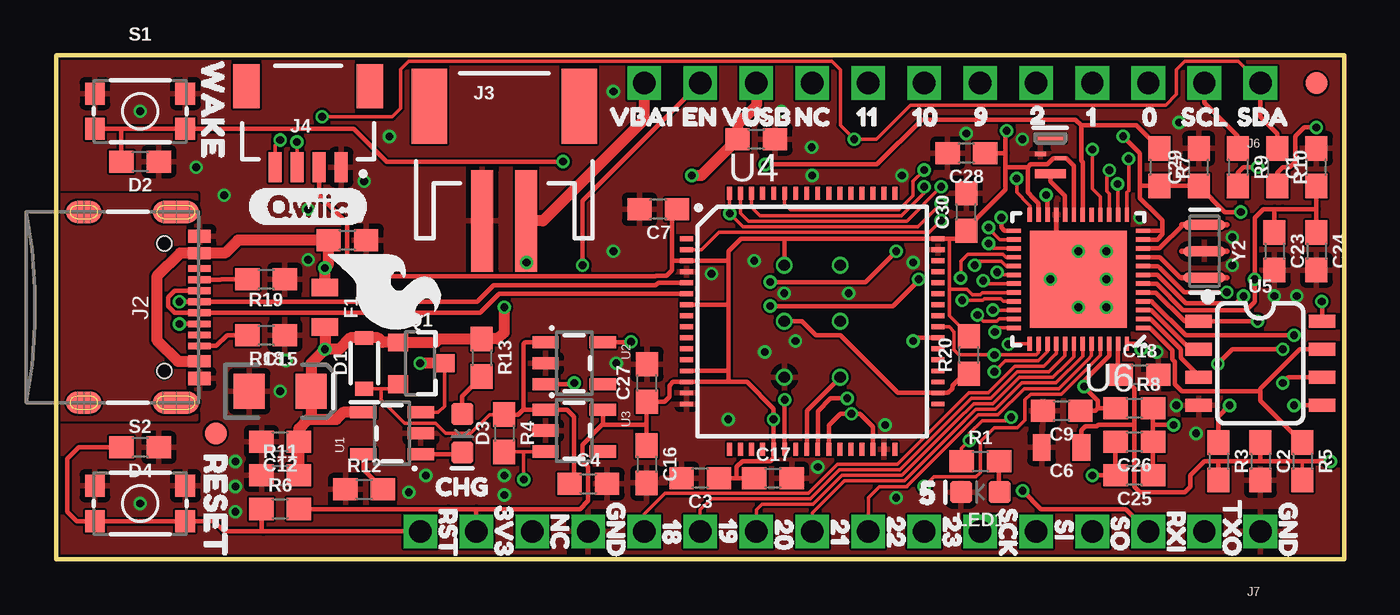
[diagram p2: board, top side]
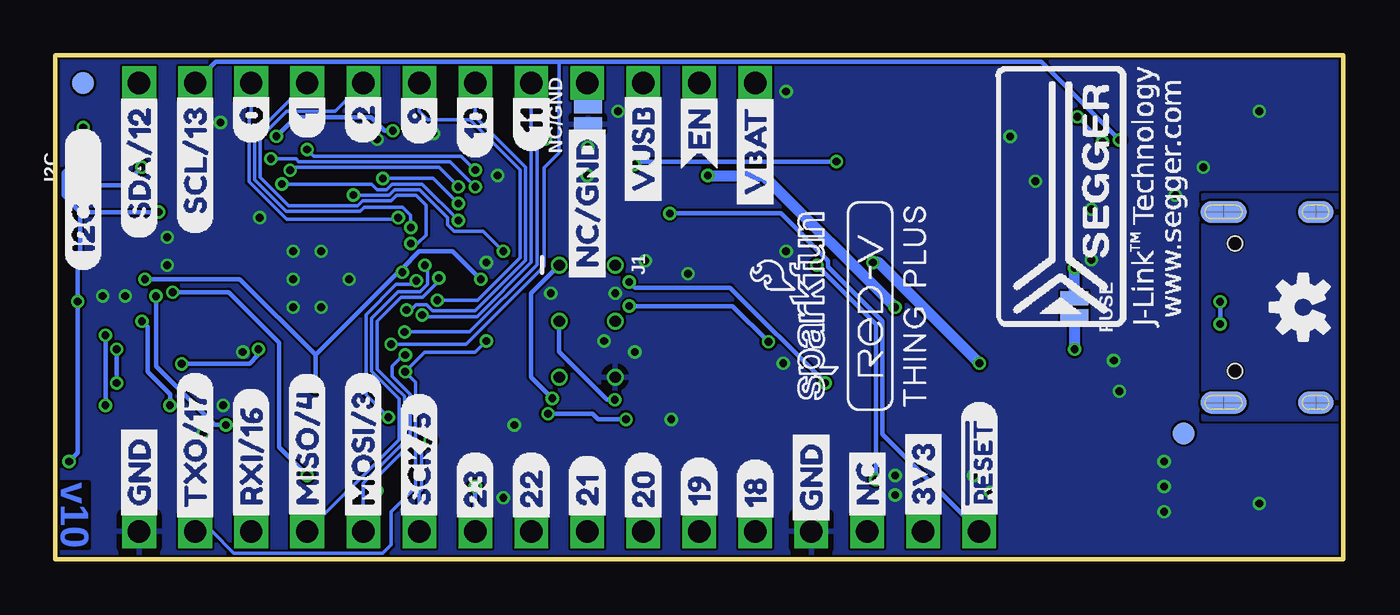
[diagram p3: board, bottom side, seen from below]

Size 58.42 x 22.86 mm. Coordinates in mm from the lower left corner, seen from the top.
Outline: 0,22.86 58.42,22.86 58.42,0 0,0 0,22.86
Copper layers (1*16): Top 0.035mm / dielectric 1.5mm / Bottom 0.035mm
Design rules "SparkFun-2-layer-FAB-LIMIT": minimum track width 4mil, minimum drill 6mil, track to track 4mil, track to pad 4mil, pad to pad 4mil, via to via 4mil, smd to smd 4mil, copper to edge 4mil, drill to drill 4mil, minimum pad ring 5mil, minimum via ring 5mil, stop-mask expansion 4mil, vias tented up to drill 25mil, thermal gap 10mil

### Footprints (pad centres in the part's own frame; a part is rotated, then mirrored left to right if it is on the bottom)
0603 = smd 1.1 x 1: 1 -0.85,0; 2 0.85,0
0805 = smd 0.8 x 1.2: 1 -0.9,0; 2 0.9,0
EIA3216 = smd 1.4 x 1.6: + 1.4,0; - -1.4,0
SOD-323 = smd 0.63 x 0.83: A 1.15,0; C -1.15,0
LED-0603 = smd 1 x 1: A -0.877,0; C 0.877,0
SMT-JUMPER_2_NO_NO-SILK = smd 0.635 x 1.27: 1 -0.406,0; 2 0.406,0
SMT-JUMPER_3_NO_NO-SILK = smd 0.635 x 1.27: 1 -0.813,0; 2 0,0; 3 0.813,0
2X3_TEST_POINTS = drill 0.508: 1 -2.54,-1.27; 2 -2.54,1.27; 3 0,-1.27; 4 0,1.27; 5 2.54,-1.27; 6 2.54,1.27
USB-C-16P = smd 0.3 x 1.016: A5 -1.25,0.154; A6 -0.25,0.154; A7 0.25,0.154; A8 1.25,0.154; B5 1.75,0.154; B6 0.75,0.154; B7 -0.75,0.154; B8 -1.75,0.154 | smd 0.6 x 1.016: GND -3.225,0.154; GND2 3.225,0.154 | smd 1 x 2.1: SHLD1 -4.32,-0.915; SHLD2 4.32,-0.915 | smd 1 x 2.1 bottom: SHLD3 -4.32,-0.915; SHLD4 4.32,-0.915 | smd 1 x 1.6: SHLD5 -4.32,-5.095; SHLD8 4.32,-5.095 | smd 1 x 1.6 bottom: SHLD6 -4.32,-5.095; SHLD7 4.32,-5.095 | smd 0.55 x 1.016: VBUS1 -2.45,0.154; VBUS2 2.45,0.154 | hole 0.65: -2.89,-1.445; 2.89,-1.445
JST-2-SMD = smd 1 x 4.6: 1 -1,-3.7; 2 1,-3.7 | smd 1.6 x 3.4: NC1 -3.4,1.5; NC2 3.4,1.5
JST04_1MM_RA = smd 0.6 x 1.35: 1 -1.5,0; 2 -0.5,0; 3 0.5,0; 4 1.5,0 | smd 1.2 x 2: NC1 2.8,-3.675; NC2 -2.8,-3.675
1X12_SM_SQ_NOSILK = drill 1.016 pad 1.27 square: 1 0,0; 2 2.54,0; 3 5.08,0; 4 7.62,0; 5 10.16,0; 6 12.7,0; 7 15.24,0; 8 17.78,0; 9 20.32,0; 10 22.86,0; 11 25.4,0; 12 27.94,0
1X16_SM_SQ_NOSILK = drill 1.016 pad 1.27 square: 1 0,0; 2 2.54,0; 3 5.08,0; 4 7.62,0; 5 10.16,0; 6 12.7,0; 7 15.24,0; 8 17.78,0; 9 20.32,0; 10 22.86,0; 11 25.4,0; 12 27.94,0; 13 30.48,0; 14 33.02,0; 15 35.56,0; 16 38.1,0
FIDUCIAL-1X2 = smd 1 x 1: 1 0,0
SOT23-3 = smd 0.8 x 0.9: 1 -0.95,-1; 2 0.95,-1; 3 0,1.1
TACTILE_SWITCH_SMD_4.6X2.8MM = smd 0.9 x 1: 1 -2.05,-0.8; 2 2.05,-0.8; 3 2.05,0.8; 4 -2.05,0.8
SOT23-5 = smd 0.55 x 1.2: 1 -0.95,-1.3; 2 0,-1.3; 3 0.95,-1.3; 4 0.95,1.3; 5 -0.95,1.3
LQFP-64 = smd 0.6 x 0.22: 1 -5.7,3.75; 2 -5.7,3.25; 3 -5.7,2.75; 4 -5.7,2.25; 5 -5.7,1.75; 6 -5.7,1.25; 7 -5.7,0.75; 8 -5.7,0.25; 9 -5.7,-0.25; 10 -5.7,-0.75; 11 -5.7,-1.25; 12 -5.7,-1.75; 13 -5.7,-2.25; 14 -5.7,-2.75; 15 -5.7,-3.25; 16 -5.7,-3.75; 33 5.7,-3.75; 34 5.7,-3.25; 35 5.7,-2.75; 36 5.7,-2.25; 37 5.7,-1.75; 38 5.7,-1.25; 39 5.7,-0.75; 40 5.7,-0.25; 41 5.7,0.25; 42 5.7,0.75; 43 5.7,1.25; 44 5.7,1.75; 45 5.7,2.25; 46 5.7,2.75; 47 5.7,3.25; 48 5.7,3.75 | smd 0.22 x 0.6: 17 -3.75,-5.8; 18 -3.25,-5.8; 19 -2.75,-5.8; 20 -2.25,-5.8; 21 -1.75,-5.8; 22 -1.25,-5.8; 23 -0.75,-5.8; 24 -0.25,-5.8; 25 0.25,-5.8; 26 0.75,-5.8; 27 1.25,-5.8; 28 1.75,-5.8; 29 2.25,-5.8; 30 2.75,-5.8; 31 3.25,-5.8; 32 3.75,-5.8; 49 3.75,5.8; 50 3.25,5.8; 51 2.75,5.8; 52 2.25,5.8; 53 1.75,5.8; 54 1.25,5.8; 55 0.75,5.8; 56 0.25,5.8; 57 -0.25,5.8; 58 -0.75,5.8; 59 -1.25,5.8; 60 -1.75,5.8; 61 -2.25,5.8; 62 -2.75,5.8; 63 -3.25,5.8; 64 -3.75,5.8
SO08 = smd 0.6 x 1.2: 1 -1.905,-2.8; 2 -0.635,-2.8; 3 0.635,-2.8; 4 1.905,-2.8; 5 1.905,2.8; 6 0.635,2.8; 7 -0.635,2.8; 8 -1.905,2.8
QFN-48-.4MMPITCH = smd 0.65 x 0.2: 1 -2.925,2.2; 2 -2.925,1.8; 3 -2.925,1.4; 4 -2.925,1; 5 -2.925,0.6; 6 -2.925,0.2; 7 -2.925,-0.2; 8 -2.925,-0.6; 9 -2.925,-1; 10 -2.925,-1.4; 11 -2.925,-1.8; 12 -2.925,-2.2; 25 2.925,-2.2; 26 2.925,-1.8; 27 2.925,-1.4; 28 2.925,-1; 29 2.925,-0.6; 30 2.925,-0.2; 31 2.925,0.2; 32 2.925,0.6; 33 2.925,1; 34 2.925,1.4; 35 2.925,1.8; 36 2.925,2.2 | smd 0.2 x 0.65: 13 -2.2,-2.925; 14 -1.8,-2.925; 15 -1.4,-2.925; 16 -1,-2.925; 17 -0.6,-2.925; 18 -0.2,-2.925; 19 0.2,-2.925; 20 0.6,-2.925; 21 1,-2.925; 22 1.4,-2.925; 23 1.8,-2.925; 24 2.2,-2.925; 37 2.2,2.925; 38 1.8,2.925; 39 1.4,2.925; 40 1,2.925; 41 0.6,2.925; 42 0.2,2.925; 43 -0.2,2.925; 44 -0.6,2.925; 45 -1,2.925; 46 -1.4,2.925; 47 -1.8,2.925; 48 -2.2,2.925 | smd 4.4 x 4.4: 49 0,0
CRYSTAL-SMD-2X1.2MM = smd 0.4 x 1.4: 1 -0.8,0; 3 0.8,0 | smd 0.2 x 0.5: 2 -0.1,-0.45; 4 0.1,0.45
RESONATOR-SMD-3.2X1.3 = smd 0.45 x 1.905: 1 -1.2,0; 2 0,0; 3 1.2,0

### Placement (x,y rotation side)
C1  57.15,17.78 90 top
C2  54.61,4.45 270 top
C3  29.21,3.68 180 top
C4  24.13,3.43 0 top
C5  31.75,19.05 0 top
C6  45.59,5.08 180 top
C7  27.3,15.88 180 top
C9  45.59,6.73 180 top
C10  13.21,14.48 0 top
C12  10.16,5.33 180 top
C15  10.16,7.62 0 top
C16  26.78,4.32 270 top
C17  32.51,3.68 0 top
C18  49.14,8.37 0 top
C23  55.24,13.97 270 top
C24  57.15,13.97 270 top
C25  48.9,3.81 180 top
C26  48.9,5.33 180 top
C27  26.8,8 90 top
C28  41.27,18.41 180 top
C29  51.82,17.78 90 top
C30  41.27,15.75 90 top
D1  13.97,8.89 90 top
D2  3.81,18.03 180 top
D3  18.41,5.71 270 top
D4  3.81,5.08 180 top
F1  12.19,11.43 270 top
FRAME1  2.27,-8.11 0 top  (outside the outline)
FRAME2  2.27,-8.11 0 top  (outside the outline)
FUSE  12.19,11.43 270 bottom
I2C  57.15,17.78 90 bottom
J1  34.29,10.79 270 bottom
J2  6.35,11.43 270 top
J3  20.32,19.05 0 top
J4  11.43,17.78 180 top
J6  54.61,21.59 180 top
J7  54.61,1.27 180 top
JP8  7.24,5.71 0 top
JP9  57.15,21.59 0 top
JP15  57.15,21.59 0 bottom
JP16  7.24,5.71 0 bottom
LED1  41.91,3.05 180 top
LOGO2  14.86,12.13 270 top
NC/GND  34.26,20.13 90 bottom
Q1  16.51,8.89 270 top
R1  41.91,4.45 0 top
R3  52.7,4.45 270 top
R4  20.32,5.71 270 top
R5  56.52,4.45 270 top
R6  10.16,2.29 0 top
R7  50.04,17.78 270 top
R8  48.9,6.86 0 top
R9  53.59,17.78 270 top
R10  55.37,17.78 270 top
R11  10.16,3.81 0 top
R12  13.97,3.17 0 top
R13  19.3,9.14 270 top
R18  9.53,10.16 180 top
R19  9.53,12.7 180 top
R20  41.4,9.27 90 top
S1  3.81,20.32 0 top
S2  3.81,2.54 0 top
U1  15.24,5.71 90 top
U2  23.5,8.89 270 top
U3  23.5,5.84 270 top
U4  34.29,10.79 0 top
U5  54.61,8.89 270 top
U6  46.35,12.7 180 top
U$1  [(QWIIC)]  8.64,16 0 top
U$2  [96]  40.89,20.07 0 top
U$3  [26]  43.43,20.13 0 top
U$4  [15]  45.97,20.07 0 top
U$5  [04]  48.51,20.07 0 top
U$6  [SDA9]  52.83,20.07 0 top
U$8  [TXO1]  53.34,3.43 270 top
U$9  [107]  38.1,20.07 0 top
U$11  [118]  35.56,20.07 0 top
U$12  [1811]  27.94,2.54 270 top
U$13  [RED#V_THING_PLUS_BOARD_SILK#02#JPG]  19.43,11.56 90 bottom
U$14  [1912]  30.48,2.54 270 top
U$15  [2013]  33.02,2.54 270 top
U$16  1.83,11.43 90 bottom
U$17  [2114]  35.56,2.54 270 top
U$18  [2215]  38.1,2.67 270 top
U$19  [2316]  40.64,2.67 270 top
U$20  [EN18]  27.69,20.07 0 top
U$21  [GND0]  55.88,3.3 270 top
U$22  [NC17]  22.86,2.79 270 top
U$23  [RXI2]  50.8,2.92 270 top
U$24  [SCK5]  43.18,3.05 270 top
U$25  [SCL10]  50.29,20.07 0 top
U$26  [VBAT19]  24.38,20.07 0 top
U$27  [NC17]  32.77,20.07 0 top
U$28  [GND0]  25.4,3.3 270 top
U$29  [#RESET34]  16.51,1.4 90 bottom
U$30  [3V332]  20.32,3.17 270 top
U$31  [3V333]  19.05,1.52 90 bottom
U$32  [015]  49.53,18.8 90 bottom
U$33  [114]  46.99,19.05 90 bottom
U$34  [213]  44.45,18.8 90 bottom
U$35  [912]  41.91,18.8 90 bottom
U$36  [1011]  39.37,18.16 90 bottom
U$37  [1110]  36.83,18.41 90 bottom
U$38  [CHG0]  16.46,3.3 0 top
U$39  [1828]  26.67,1.4 90 bottom
U$40  [1927]  29.21,1.52 90 bottom
U$41  [2026]  31.75,1.4 90 bottom
U$42  [RED#V_THING_PLUS_BOARD_SILK#01#JPG]  21.46,11.49 90 bottom
U$43  [2125]  34.29,1.52 90 bottom
U$44  [2224]  36.83,1.4 90 bottom
U$45  [SEGGERLOGO#PNG]  10.54,16.26 90 bottom
U$46  [50]  38.22,3.03 0 top
U$47  [2323]  39.37,1.4 90 bottom
U$48  [EN8]  29.21,17.65 90 bottom
U$49  [ASDFKJGHB#JPG]  24.89,11.68 90 bottom
U$50  [I2C_______0]  57.15,13.02 90 bottom
U$51  [GND29]  24.13,1.3 90 bottom
U$52  [MISO#421]  46.99,1.52 90 bottom
U$53  [MOSI#320]  44.45,1.52 90 bottom
U$54  [NC#GND31]  34.29,12.32 90 bottom
U$55  [NC30]  21.59,1.52 90 bottom
U$56  [RST2]  17.78,3.05 270 top
U$57  [RXI#1619]  49.53,1.52 90 bottom
U$58  [SCK#522]  41.91,1.52 90 bottom
U$59  [SCL#1316]  52.07,14.73 90 bottom
U$60  [SDA#1217]  54.61,14.48 90 bottom
U$61  [SI0]  45.72,2.54 270 top
U$62  [SO1]  48.26,2.67 270 top
U$63  [TXO#1718]  52.07,1.4 90 bottom
U$64  [VBAT7]  26.67,15.62 90 bottom
U$65  [VUSB3]  29.46,20.07 0 top
U$66  [VUSB9]  31.75,15.75 90 bottom
U$67  [GND29]  54.61,1.52 90 bottom
U$68  [RESET1]  7.24,5.71 270 top
U$69  [WAKE0]  7.11,23.5 270 top
Y1  45.09,18.29 270 top
Y2  52.07,13.97 270 top

### Tracks (layer width: path | path; a pad name or v marks a point on that pad's centre or on a via)
1.8V  (via drill 0.35)
  Top 0.152: v42.67,13.02 42.79,12.9 U6.30
  Top 0.203: C24.1 57.15,15.88 | 57.15,15.88 C1.1 | 57.15,15.88 55.63,15.88 55.24,15.88 | C23.1 55.24,15.88 | C9.1 47.12,6.73 47.24,6.86 | R8.1 47.88,6.86 47.24,6.86 | 54.36,12.7 54.36,11.68 53.98,11.3 51.1,11.3 49.91,12.5 U6.6 | 54.36,12.7 54.36,15.49 54.74,15.88 55.24,15.88 | v26.07,9.87 26.05,9.84 U2.5 | v32.38,11.49 37.95,11.49 39.12,12.65 v39.12,12.7 | 47.24,6.86 47.24,7.2 46.91,7.54 v46.61,7.83 46.61,8.09 47.76,9.23 U6.46 | v54.34,12.7 54.36,12.7
  Bottom 0.203: v32.38,11.49 27.7,11.49 v26.07,9.87 | 46.61,9.27 42.86,13.02 v42.67,13.02 42.67,13.21 41.91,13.97 40.39,13.97 v39.12,12.7 | v46.61,7.83 46.61,9.27 | 46.61,9.27 50.04,12.7 v54.34,12.7
3.3V  (via drill 0.35)
  Top 0.152: 40.51,12.26 41.3,12.26 41.55,12 41.91,12 42.01,12.1 U6.32 | 40.51,12.26 40.51,11.05 41.4,10.16 R20.2 | 40.51,12.26 40.51,13.97 | 40.51,13.97 40.51,14.54 | 56.52,3.81 56.52,4.45 | 40.51,13.97
  Top 0.203: 54.61,4.45 52.7,4.45 | 52.7,4.45 52.07,4.45 51.44,3.81 51.44,3.3 51.18,3.05 49.15,3.05 48.9,3.3 48.9,6.1 | R3.2 52.7,4.45 | C2.1 54.61,4.45 | R6.2 17.78,2.29 19.05,2.29 | 19.05,2.29 23.75,2.29 24.13,2.67 24.13,4.19 23.88,4.45 23.88,5.21 24.77,6.1 | J7.15 19.05,2.29 | 30.48,8.04 31.32,8.04 32.54,6.83 v32.54,6.35 | 26.78,6.1 26.78,7.13 C27.1 27.6,7.15 27.81,7.37 27.81,7.87 27.98,8.04 U4.14 30.48,8.04 | 26.78,6.1 C16.1 | 24.77,6.1 26.78,6.1 | U3.5 24.8,6.13 24.77,6.1 | 30.86,3.68 C17.1 | 30.86,3.68 30.86,4.19 31.11,4.45 32.38,4.45 32.54,4.6 U4.21 v32.54,6.35 | C3.1 30.86,3.68 | 48.16,8.51 C18.1 | C6.1 46.49,5.85 46.67,6.03 47.2,6.03 47.27,6.1 48.9,6.1 | C18.1 48.9,7.77 48.9,6.1 | 50.16,15.24 50.16,14.86 50.16,14.73 49.93,14.5 U6.11 | 50.16,15.24 50.16,14.9 U6.12 | 44.07,17.78 44.07,16.64 44.32,16.38 | 44.55,16.15 44.32,16.38 | 46.16,17.85 45.97,18.03 | 45.97,18.03 45.82,18.19 Y1.4 45.23,18.19 44.95,17.91 44.19,17.91 44.07,17.79 44.07,17.78 | C7.1 27.94,15.66 27.94,13.59 | 27.94,13.59 27.94,13.1 27.69,12.85 27.19,12.85 27.17,12.83 15.24,12.83 14.1,12.83 13.21,13.72 13.21,15.24 11.93,16.52 J4.2 | 27.94,13.59 27.98,13.54 U4.3 30.44,13.54 | 30.48,13.59 30.48,13.97 31.05,14.54 33.02,14.54 | 30.48,13.59 30.48,11.56 | 30.48,11.56 30.48,8.89 30.48,8.51 | 30.48,8.51 30.48,8.04 | 33.02,14.54 35.56,14.54 U4.48 40.51,14.54 40.92,14.54 C30.1 41.27,14.99 43.06,16.77 43.06,17.78 | 30.44,13.54 30.48,13.59 | 30.48,11.56 30.47,11.54 U4.7 | 30.48,8.51 30.44,8.54 U4.13 | v57.4,11.69 57.41,11.68 U5.8 | 54.61,4.45 55.88,4.45 56.39,4.45 56.52,4.45 v57.78,4.45 | 56.52,3.81 R5.2 | 44.32,16.38 44.55,16.15 | 44.55,16.15 U6.23
  Top 0.203: 45.97,18.03 46.16,17.85 | 46.16,17.85 U6.19 | C18.1 48.16,8.51 | 48.16,8.51 U6.47 | 50.16,15.24 50.16,15.37 49.91,15.62 49.15,16.38 49.15,16.51 | v48.38,19.18 49.15,18.41 49.15,16.89 | 49.15,16.89 49.15,16.51 | 43.06,17.78 43.06,18.41 | C28.1 43.06,18.41 | 43.06,18.41 43.06,19.38 v43.11,19.43 | 44.07,17.78 43.06,17.78 | 49.15,16.51 | 49.15,16.51 | 49.15,16.89 49.19,16.93 R7.2 C29.1 53,15.75 v53.72,15.75 | 30.44,13.54 30.48,13.59 | U4.30 37.04,6.01 36.45,6.6 v36.07,6.6 35.56,6.6 35.04,6.08 U4.26 | J1.2 33.02,14.54 | v32.53,6.35 v32.54,6.35
  Bottom 0.203: v48.38,19.18 47.52,20.04 44.09,20.04 43.48,19.43 v43.11,19.43 | v57.78,4.45 57.4,4.83 v57.4,11.69 57.4,13.85 57.28,13.97 57.28,15.75 | v36.07,6.6 34.06,6.6 33.8,6.35 v32.53,6.35 | I2C.2 57.78,17.78 58.04,17.53 58.04,16.51 57.28,15.75 | 57.28,15.75 v53.72,15.75
5V
  Top 0.152: 21.21,6.79 21.18,6.79 | D1.C 14.73,7.74 | 14.73,7.74 15.31,7.74 Q1.2 | R4.1 19.65,6.57 18.8,5.71 17.67,5.71 17.21,6.17 15.8,6.17 14.73,7.24 14.73,7.74
  Top 0.203: 21.18,6.79 20.95,6.57 R4.1 | C4.1 23.5,3.64 23.5,6.48 23.18,6.79 U3.1 21.21,6.79 21.21,9.78 21.27,9.84 U2.1
!RESET  (via drill 0.35)
  Top 0.152: v40.13,16.13 39.08,15.08 31.15,15.08 v30.54,15.68 U4.64 | 44.16,16.04 44.07,16.13 | 44.07,16.13 43.56,16.64 v43.56,17.27 | 44.07,16.13 44.16,16.04 | 44.16,16.04 U6.24
  Top 0.203: D4.2 1.02,5.08 0.51,4.57 0.51,2.16 0.93,1.74 S2.1 S2.2 7.15,1.74 7.62,1.27 9.4,1.27 | J7.16 9.4,1.27 | R6.1 9.31,1.36 9.4,1.27
  Bottom 0.152: v43.56,17.27 41.27,17.27 v40.13,16.13
  Bottom 0.203: J7.16 20.9,5.66 20.9,10.79 23.37,13.26 23.37,13.54 25.51,15.68 v30.54,15.68
!WAKE  (via drill 0.35)
  Top 0.203: 2.92,19.52 S1.2 13.5,19.52 14.99,18.03 v22.99,18.03 | 2.92,19.52 S1.1 | D2.2 2.96,19.48 2.92,19.52 | v32.15,17.91 37.23,17.91 39.26,19.94 46.23,19.94 46.48,19.68 | R7.1 48.98,19.68 46.48,19.68 | 46.55,18.01 46.48,18.08 | 46.48,18.08 46.48,19.68 | 46.48,18.08 46.55,18.01 | 46.55,18.01 U6.18
  Bottom 0.203: v22.99,18.03 32.03,18.03 v32.15,17.91
CORE_ENABLE  (via drill 0.35)
  Top 0.203: 44.95,16.46 v44.9,16.52 44.95,16.46 | v38.1,13.97 36.7,12.57 v32.38,12.57 | v23.5,8 23.43,7.94 U2.3 | 44.95,16.46 U6.22
  Bottom 0.152: v44.9,16.52 44.82,16.52 44.81,16.51 43.28,16.51 43.03,16.76 41.89,16.76 40.61,15.49 40.61,15.17 40.33,14.89 39.02,14.89 v38.1,13.97
  Bottom 0.203: v23.5,8 27.81,12.32 32.13,12.32 v32.38,12.57
D+  (via drill 0.35)
  Top 0.203: J2.B6 v5.6,10.68 v5.59,10.67 | v5.59,11.68 J2.A6 19.09,11.68 19.83,12.42 27.19,12.42 27.32,12.54 U4.5
  Bottom 0.203: v5.59,10.67 v5.59,11.68
D-
  Top 0.203: J2.B7 5.81,12.18 5.8,12.19 5.38,12.19 5.08,11.89 5.08,11.47 5.38,11.18 5.8,11.18 J2.A7 19.22,11.18 20.08,12.04 U4.6
DBG_RESET
  Top 0.203: R20.1 41.19,8.42 40.64,7.87 40.64,7.75 40.44,7.54 U4.34 38.17,7.54 35.56,10.16 34.46,10.16 33.83,10.79 J1.4
DBG_SWDCLK  (via drill 0.35)
  Top 0.203: v33.05,7.24 v33.04,7.23 U4.22
  Bottom 0.203: v33.05,7.24 33.39,7.24 35.56,9.41 35.56,10.16 J1.3
DBG_SWDIO  (via drill 0.35)
  Top 0.203: U4.25 34.54,6.73 35.12,7.3 v35.88,7.3
  Bottom 0.203: v35.88,7.3 36.83,8.25 36.83,12.06 J1.1
DBG_SWO
  Top 0.203: J1.5 34.04,6.74 U4.24
EN  (via drill 0.35)
  Top 0.152: U3.3 21.21,4.89 | 21.21,4.89 20.35,4.89 R4.2 | v21.21,3.62 21.21,4.89
  Top 0.203: J6.11 23.88,16.26 v23.88,13.34
  Bottom 0.203: v21.21,3.62 21.21,10.67 v23.88,13.34
GND  (via drill 0.35)
  Top 0.152: v46.35,13.97 U6.49 46.35,13.62 45.35,14.62
  Top 0.203: U6.21 45.35,14.62
  other vias: 34.54,4.19 37.59,6.1 30.48,6.35 25.4,8.89 47.62,11.43 47.62,12.7 46.35,11.43 45.09,12.7 47.62,13.97 43.81,19.05 41.27,19.3 34.29,17.4 32.89,20.32 31.66,13.54 35.94,12.06 32.13,9.4 53.34,14.61 53.34,13.34 49.91,9.4 50.8,6.99 51.69,5.71 33.53,9.91 33.02,12.06 38.86,13.46 38.35,17.4 13.97,17.14 11.43,15.88 29.72,12.95 25.27,13.97 55.24,11.94 56.26,11.94 11.43,13.59 10.41,9.02 49.15,15.49 20.32,3.81 20.32,2.92 16,3.05 16.76,3.81 8.13,4.45 8.13,3.3 8.13,2.16 10.16,7.62 7.62,16.51 3.81,20.32 6.35,17.78 15.11,19.18 25.27,21.21 3.81,2.54 50.93,19.81 38.1,2.79 34.26,18.69
  pour Bottom (rank 2): 0,22.86 0,0 58.42,0 58.42,22.86
  pour Top (rank 2): 58.42,22.86 58.42,0 0,0 0,22.86
IO0  (via drill 0.35)
  Top 0.203: U6.25 43.01,14.9 42.86,15.05 v42.86,15.49
  Bottom 0.152: J6.3 49.53,20.32 49.63,20.22 49.63,17.12 47.93,15.42 42.94,15.42 v42.86,15.49
IO1  (via drill 0.35)
  Top 0.152: v42.29,15.05 42.29,15 42.79,14.5 U6.26
  Bottom 0.152: v42.29,15.05 42.29,15.6 42.66,15.97 44.41,15.97 44.59,15.79 47.94,15.79 49.38,17.22 49.38,19.23 47.01,21.59 J6.4
IO2  (via drill 0.35)
  Top 0.152: v42.29,14.32 42.51,14.1 U6.27
  Bottom 0.152: v42.29,14.32 41.97,14.32 41.59,14.7 41.59,16.05 42.05,16.51 42.93,16.51 43.18,16.26 44.49,16.26 44.7,16.04 47.84,16.04 48.03,16.23 48.28,16.49 49.12,17.33 49.12,19.12 47.92,20.32 45.72,20.32 J6.5
IO9  (via drill 0.35)
  Top 0.152: v41.08,11.75 42.04,11.75 42.1,11.81 42.84,11.81 42.95,11.7 U6.33
  Bottom 0.152: v41.08,11.75 39.26,11.75 37.34,13.67 37.34,17.68 39.6,19.94 41.53,19.94 41.91,20.32 J6.6
IO10  (via drill 0.35)
  Top 0.152: v42.48,11.3 | v42.48,11.3 U6.34
  Bottom 0.152: J6.7 39.37,20.07 37.08,17.78 37.08,13.57 39.39,11.27 41.29,11.27 41.58,11.55 42.04,11.55 42.29,11.3 v42.48,11.3
IO11  (via drill 0.35)
  Top 0.152: v41.78,11.07 42.06,10.79 42.67,10.79 42.78,10.9 U6.35
  Bottom 0.152: J6.8 36.83,13.46 39.28,11.01 41.72,11.01 v41.78,11.07
IO18
  Top 0.152: 45.35,9.33 45.32,9.29 | 45.32,9.29 44.79,8.76 43.48,8.76 42.28,7.57 41.4,7.57 38.15,4.32 35.42,4.32 34.11,3 27.62,3 26.67,2.06 J7.12 | 45.32,9.29 45.35,9.33 | 45.35,9.33 U6.40
IO19
  Top 0.152: 45.76,9.24 45.56,9.05 | 45.56,9.05 45.02,8.51 43.58,8.51 42.39,7.31 41.51,7.31 38.26,4.06 36.83,4.06 35.53,4.06 34.22,2.75 29.72,2.75 29.21,2.24 J7.11 | 45.56,9.05 45.76,9.24 | 45.76,9.24 U6.41
IO20
  Top 0.152: 46.16,9.2 45.78,8.83 | 45.78,8.83 45.21,8.26 43.69,8.26 42.49,7.06 41.61,7.06 40.81,6.26 38.36,3.81 35.64,3.81 35.6,3.77 34.32,2.5 32,2.5 31.75,2.24 J7.10 | 45.78,8.83 46.16,9.2 | 46.16,9.2 U6.42
IO21
  Top 0.152: J7.9 34.29,2.1 35.74,3.56 38.47,3.56 41.72,6.8 42.6,6.8 43.79,8 45.34,8 46.55,9.22 U6.43
IO22
  Top 0.152: 46.8,9.08 45.47,7.75 43.9,7.75 42.7,6.55 41.82,6.55 38.59,3.32 | 46.8,9.08 46.95,9.24 | 38.57,3.3 38.59,3.32 | 46.8,9.08 46.95,9.24 | 46.95,9.24 U6.44 | 38.59,3.32 | 38.59,3.32 38.57,3.3 | 38.57,3.3 37.34,3.3 36.83,2.79 J7.8
IO23  (via drill 0.35)
  Top 0.152: 46.99,8.89 45.59,7.49 44.2,7.49 43.94,7.23 43.94,6.31 43.59,5.97 42.55,5.97 41.91,5.33 41.91,3.94 41.72,3.75 39.8,3.75 39.37,3.31 v39.37,3.3 | 46.99,8.89 47.35,9.26 | 46.99,8.89 47.35,9.26 | 47.35,9.26 U6.45
  Bottom 0.203: J7.7 v39.37,3.3
N$1
  Top 0.203: R1.2 42.76,3.08 LED1.A
N$3
  Top 0.203: Y2.1 51.11,15.17 50.04,14.1 49.53,14.1 U6.10
N$4
  Bottom 0.508: NC/GND.2 34.26,21.56 J6.9
N$5  (via drill 0.35)
  Top 0.203: v54.48,17.78 53.85,17.78 53.59,17.53 R9.2
  Bottom 0.203: I2C.1 55.3,16.97 v54.48,17.78
N$6  (via drill 0.35)
  Top 0.203: R10.2 55.37,17.53 55.63,17.78 55.94,17.78 56.2,18.03 56.2,19.18 56.6,19.58 v57.15,19.58
  Bottom 0.203: v57.15,19.58 I2C.3
N$7
  Top 0.203: Y2.3 50.98,12.77 50.05,13.7 U6.9
N$8
  Top 0.203: Y1.3 45.09,17.14 45.76,16.48 U6.20
N$9
  Top 0.203: R12.2 13.94,4.05 U1.5
N$10  (via drill 0.35)
  Top 0.203: C26.2 C25.2 v46.99,3.81 | v53.09,12.11 51.16,12.11 50.05,13.22 | 50.05,13.22 49.97,13.3 | 50.05,13.22 49.97,13.3 | 49.97,13.3 U6.8
  Bottom 0.203: v46.99,3.81 48.26,5.08 48.26,9.82 50.55,12.11 v53.09,12.11
N$11
  Top 0.203: U1.1 18.34,4.76 D3.C
N$12
  Top 0.203: J2.B5 7.27,9.68 7.75,10.16 R18.2
N$14
  Top 0.203: R13.2 18.41,7.41 D3.A
N$17
  Top 0.203: J2.A5 7.47,12.68 7.49,12.7 R19.2
PLL_AVDD  (via drill 0.35)
  Top 0.203: C25.1 C26.1 49.74,6.1 | R8.2 49.74,6.1 | v50.68,6.1 49.74,6.1 | v53.85,11.94 53.52,11.61 51.31,11.61 51.44,11.61 51.23,11.61 49.94,12.9 U6.7
  Bottom 0.203: v50.68,6.1 51.18,6.1 53.85,8.76 v53.85,11.94
QSPI_0  (via drill 0.35)
  Top 0.203: 49.69,11.7 49.75,11.65 | 49.75,11.65 51.23,10.16 v56.13,10.16 | v56.13,6.99 U5.5 | 49.75,11.65 49.69,11.7 | 49.69,11.7 U6.4
  Bottom 0.203: v56.13,10.16 v56.13,6.99
QSPI_1
  Top 0.203: 51.44,9.53 U5.2 51.44,9.53 | U6.3 49.66,11.3 51.44,9.53
QSPI_2
  Top 0.203: U5.3 51.81,8.34 51.01,9.14 51.01,9.52 49.63,10.9 U6.2
QSPI_3
  Top 0.203: R5.1 54.61,7.2 54.61,7.62 | U5.7 56.39,9.53 54.61,7.75 54.61,7.62 | 54.61,7.62 51.05,7.62 50.74,7.93 50.74,8.96 50.62,9.07 50.62,9.47 49.6,10.5 U6.1
QSPI_CS  (via drill 0.35)
  Top 0.203: v54.48,10.79 U5.1 51.18,10.79 49.88,12.1 U6.5 | v53.21,6.99 52.7,6.48 R3.1
  Bottom 0.203: v54.48,10.79 54.23,10.54 54.23,8.51 53.21,7.49 v53.21,6.99
QSPI_SCK  (via drill 0.35)
  Top 0.203: v52.68,8.87 53.34,9.53 v55.63,9.53 | v55.63,8 55.88,8.26 U5.6 | v49.2,9.53 48.95,9.78 U6.48
  Bottom 0.203: v52.68,8.87 49.61,8.87 49.2,9.27 v49.2,9.53 | v55.63,9.53 v55.63,8
RXI  (via drill 0.35)
  Top 0.152: U6.38 44.55,9.38 44.45,9.27 v42.55,9.27 40.95,9.27 40.72,9.5 40.72,10.33 40.51,10.54 U4.40
  Top 0.203: J7.3 48.51,2.29 45,2.29 44.83,2.29 44.66,2.29 v43.83,3.11
  Bottom 0.152: v42.55,9.27 42.62,9.27 43.13,8.76 43.13,8.3 42.32,7.49 42.32,5.22 43.83,3.71 v43.83,3.11
SCL  (via drill 0.35)
  Top 0.152: J4.4 9.93,18.79 v10.16,19.02 | v43.18,9.75 43.2,9.78 U6.37
  Top 0.203: J6.2 52.07,20.7 53.59,19.18 R9.1
  Bottom 0.152: v43.18,9.75 39.78,9.75 36.25,13.28 36.25,17.76 35.56,18.44 35.56,22.55
  Bottom 0.203: v10.16,19.02 13.7,22.55 35.56,22.55 51.14,22.55 52.07,21.62 J6.2
SDA  (via drill 0.35)
  Top 0.152: J6.1 53.62,22.58 51.18,22.58 50.8,22.2 50.8,21.09 50.31,20.6 38.75,20.6 37.2,19.05 v36.2,19.05 35.56,19.68 35.56,22.2 35.18,22.58 15.98,22.58 15.62,22.23 15.62,20.45 15.24,20.07 v12.06,20.07 | J4.3 v10.93,18.91 v10.92,18.92 | v42.57,10.31 42.76,10.5 U6.36
  Top 0.203: R10.1 55.37,19.3 54.61,20.07 J6.1
  Bottom 0.152: v42.57,10.31 39.62,10.31 36.58,13.36 36.58,18.67 v36.2,19.05 | v10.92,18.92 v12.06,20.07
SHLD
  pour Bottom: 0,16.51 6.35,16.51 6.35,6.35 0,6.35
  pour Top: 0,16.51 6.35,16.51 6.35,6.35 0,6.35
SPI_MISO  (via drill 0.35)
  Top 0.152: v41.66,13.34 41.85,13.53 42.86,13.53 43.09,13.3 U6.29
  Bottom 0.152: v41.66,13.34 41.53,13.21 41.53,12.47 41.87,12.13 42.86,12.13 44.07,10.92 44.07,8.52 42.83,7.28 42.83,5.43 J7.4
SPI_MOSI  (via drill 0.35)
  Top 0.152: v41.02,12.76 41.02,13.53 41.34,13.84 42.93,13.84 42.99,13.78 | 42.99,13.78 43.07,13.7 | 42.99,13.78 43.07,13.7 | 43.07,13.7 U6.28
  Bottom 0.152: J7.5 44.45,3.45 42.57,5.33 42.57,7.39 42.99,7.81 43.81,8.63 43.81,10.79 42.74,11.87 41.76,11.87 41.02,12.62 v41.02,12.76
SPI_SCK  (via drill 0.35)
  Top 0.152: v42.04,12.64 42.17,12.5 U6.31 | v43.31,6.45 43.15,6.3 42,6.3 41.41,5.71 v41.41,5.39 41.06,5.03 R1.1
  Bottom 0.152: v43.31,6.45 44.32,7.46 44.32,11.09 42.95,12.47 42.21,12.47 v42.04,12.64 | J7.6 41.91,3.07 41.81,3.17 41.81,4.99 v41.41,5.39
TCK  (via drill 0.35)
  Top 0.152: v48.64,18.16 48.64,16.72 48.55,16.63 U6.13 | v39.37,16.89 39.37,16.61 38.34,15.59 31.91,15.59 31.54,15.96 U4.62
  Bottom 0.152: v39.37,16.89 40.51,18.03 47.37,18.03 47.5,18.16 v48.64,18.16
TDI  (via drill 0.35)
  Top 0.152: v39.37,17.65 38.86,17.14 38.86,16.48 38.23,15.84 33.31,15.84 33.04,16.11 U4.59 | v46.99,18.58 46.99,16.8 47.35,16.43 U6.16
  Bottom 0.152: v39.37,17.65 40.01,18.29 46.69,18.29 v46.99,18.58
TDO  (via drill 0.35)
  Top 0.152: v40.13,15.37 40.13,15.35 39.61,14.82 30.05,14.82 29.27,14.04 U4.2 | v48.13,17.02 48.16,17 U6.14
  Bottom 0.152: v48.13,17.02 44.07,17.02 43.81,16.76 43.39,16.76 43.14,17.02 41.78,17.02 v40.13,15.37
TMS  (via drill 0.35)
  Top 0.152: v40.13,16.89 38.57,15.33 31.75,15.33 31.4,15.33 31.04,15.7 U4.63 | v47.76,17.64 47.76,17.45 47.65,17.34 47.65,16.69 47.76,16.58 47.76,15.63 U6.15
  Bottom 0.152: v40.13,16.89 41.01,17.77 47.63,17.77 v47.76,17.64 | v40.13,16.89
TXO  (via drill 0.35)
  Top 0.152: 44.95,9.42 44.76,9.22 | 44.76,9.22 44.55,9.02 43.69,9.02 43.05,9.02 v42.55,8.51 | 44.76,9.22 44.95,9.42 | 44.95,9.42 U6.39
  Top 0.203: v38.86,9.91 39,10.04 U4.39
  Bottom 0.152: v38.86,9.91 39.37,9.4 41.66,9.4 v42.55,8.51 42.06,8.03 42.06,5.12 42.06,3.27 43.18,2.16 43.18,0.66 43.56,0.28 50.32,0.28 51.31,1.27 J7.2
V_BATT  (via drill 0.35)
  Top 0.152: Q1.3 17.61,6.94 17.33,6.67 U1.3
  Top 0.508: J6.12 26.67,19.94 22.08,15.35 J3.2 21.34,15.33 v21.34,13.46 | Q1.3 v16.51,8.89
  Bottom 0.508: v16.51,8.89 21.08,13.46 v21.34,13.46
V_USB  (via drill 0.35)
  Top 0.508: F1.2 v12.19,9.53 | v12.19,9.53 11.56,8.89 C15.+ 11.56,6.48 11.43,6.35 | R11.2 C12.1 11.01,5.93 11.43,6.35 | U1.4 13.02,6.67 12.7,6.35 11.43,6.35 | v12.19,9.53 12.83,9.53 13.34,10.04 D1.A 14.6,10.04 14.8,9.84 Q1.1 17.21,9.84 17.36,9.99 R13.1 20.03,9.99 20.32,10.29 v20.32,11.43 | J6.10 31.75,20.57 30.9,19.72 C5.1 29.25,17.4 v28.83,17.4
  Bottom 0.508: v28.83,17.4 26.29,17.4 v20.32,11.43 | FUSE.2 v12.19,9.53
VUSB  (via drill 0.35)
  Top 0.508: F1.1 v12.19,13.21 12.36,13.37 C10.1 8.26,14.48 7.66,13.88 J2.VBUS1 5.62,13.88 4.57,12.83 4.57,9.94 5.54,8.98 J2.VBUS2
  Bottom 0.508: FUSE.1 v12.19,13.21

### Text on the board
Bottom: v10
Measures: Units in inches
tDocu: A. England
214bmp: D:/SmartProjects/Snc/a4_bn_logo2.bmp